# EAGLE schematic PAD05 (EAGLE 8.3.2)
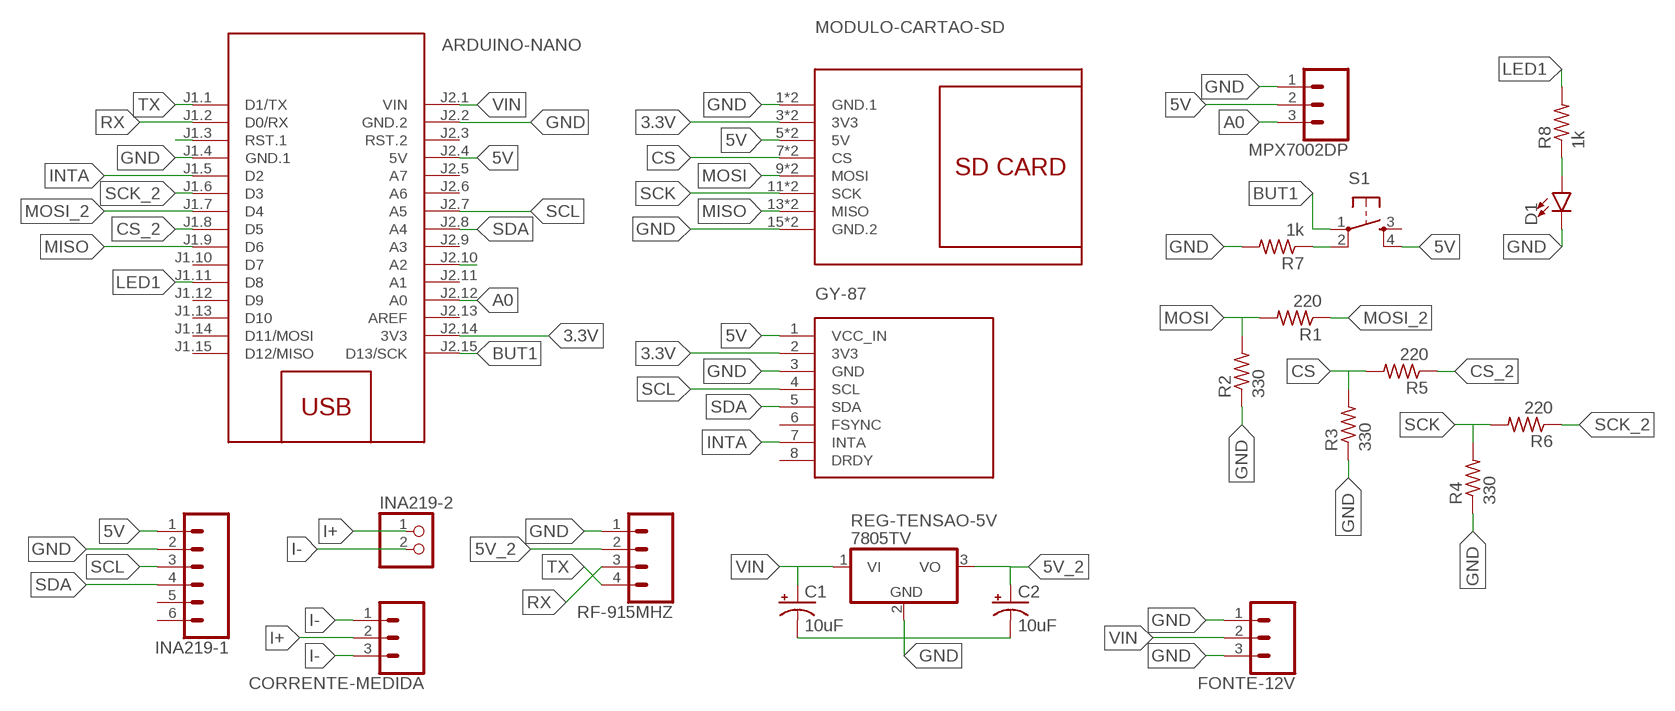
[diagram p0: schematic, sheet 1]

## Parts
ARDUINO-NANO  ARDUINO-NANO-3.0  [ARDUINO-NANO-3.0]
C1  10uF  10UF-POLAR-RADIAL-2.5MM-25V-20%  [CPOL-RADIAL-2.5MM-5MM]
C2  10uF  10UF-POLAR-RADIAL-2.5MM-25V-20%  [CPOL-RADIAL-2.5MM-5MM]
CORRENTE-MEDIDA  CONN_03POLAR  [MOLEX-1X3]
D1  LED5MM  [LED_5MM]
FONTE-12V  CONN_03POLAR  [MOLEX-1X3]
GY-87  GY-86  [GY-86]
INA219-1  CONN_06SILK_FEMALE_PTH  [1X06]
INA219-2  PINHD-1X2  [1X02]
MODULO-CARTAO-SD  CARD-SD-ADAPTER  [CARD-SD-ADAPTER]
MPX7002DP  CONN_03POLAR  [MOLEX-1X3]
R1  220  R-US_0204/7  [0204/7]
R2  330  R-US_0204/7  [0204/7]
R3  330  R-US_0204/7  [0204/7]
R4  330  R-US_0204/7  [0204/7]
R5  220  R-US_0204/7  [0204/7]
R6  220  R-US_0204/7  [0204/7]
R7  1k  R-US_0204/7  [0204/7]
R8  1k  R-US_0204/7  [0204/7]
REG-TENSAO-5V  7805TV  [TO220V]
RF-915MHZ  CONN_04  [1X04]
S1  TAC_SWITCHPTH  [TACTILE-PTH]

## Nets
3.3V: ARDUINO-NANO.J2.14(3V3) GY-87.2(3V3) MODULO-CARTAO-SD.3(3V3) MODULO-CARTAO-SD.4(3V3)
5V: ARDUINO-NANO.J1.3(RST.1) ARDUINO-NANO.J2.4(5V) GY-87.1(VCC_IN) INA219-1.1 MODULO-CARTAO-SD.5(5V) MODULO-CARTAO-SD.6(5V) MPX7002DP.2 S1.4
5V_2: C2.1(+) REG-TENSAO-5V.3(VO) RF-915MHZ.2
A0: ARDUINO-NANO.J2.12(A0) MPX7002DP.3
BUT1: ARDUINO-NANO.J2.15(D13/SCK) S1.1
CS: MODULO-CARTAO-SD.7(CS) MODULO-CARTAO-SD.8(CS) R3.2 R5.2
CS_2: ARDUINO-NANO.J1.8(D5) R5.1
GND: ARDUINO-NANO.J1.4(GND.1) ARDUINO-NANO.J2.2(GND.2) C1.2(-) C2.2(-) D1.K(C) FONTE-12V.1 FONTE-12V.3 GY-87.3(GND) INA219-1.2 MODULO-CARTAO-SD.1(GND.1) MODULO-CARTAO-SD.2(GND.1) MODULO-CARTAO-SD.15(GND.2) MODULO-CARTAO-SD.16(GND.2) MPX7002DP.1 R2.1 R3.1 R4.1 R7.2 REG-TENSAO-5V.2(GND) RF-915MHZ.1
I+: CORRENTE-MEDIDA.2 INA219-2.1
I-: CORRENTE-MEDIDA.1 CORRENTE-MEDIDA.3 INA219-2.2
INTA: ARDUINO-NANO.J1.5(D2) ARDUINO-NANO.J2.10(A2) GY-87.7(INTA)
LED1: ARDUINO-NANO.J1.11(D8) R8.2
MISO: ARDUINO-NANO.J1.9(D6) MODULO-CARTAO-SD.13(MISO) MODULO-CARTAO-SD.14(MISO)
MOSI: MODULO-CARTAO-SD.9(MOSI) MODULO-CARTAO-SD.10(MOSI) R1.2 R2.2
MOSI_2: ARDUINO-NANO.J1.7(D4) R1.1
N$1: R7.1 S1.2
N$2: D1.A R8.1
RX: ARDUINO-NANO.J1.2(D0/RX) RF-915MHZ.3
SCK: MODULO-CARTAO-SD.11(SCK) MODULO-CARTAO-SD.12(SCK) R4.2 R6.2
SCK_2: ARDUINO-NANO.J1.6(D3) R6.1
SCL: ARDUINO-NANO.J2.7(A5) GY-87.4(SCL) INA219-1.3
SDA: ARDUINO-NANO.J2.8(A4) GY-87.5(SDA) INA219-1.4
TX: ARDUINO-NANO.J1.1(D1/TX) RF-915MHZ.4
VIN: ARDUINO-NANO.J2.1(VIN) C1.1(+) FONTE-12V.2 REG-TENSAO-5V.1(VI)
Unconnected: ARDUINO-NANO.J1.10(D7) ARDUINO-NANO.J1.12(D9) ARDUINO-NANO.J1.13(D10) ARDUINO-NANO.J1.14(D11/MOSI) ARDUINO-NANO.J1.15(D12/MISO) ARDUINO-NANO.J2.3(RST.2) ARDUINO-NANO.J2.5(A7) ARDUINO-NANO.J2.6(A6) ARDUINO-NANO.J2.9(A3) ARDUINO-NANO.J2.11(A1) ARDUINO-NANO.J2.13(AREF) GY-87.6(FSYNC) GY-87.8(DRDY) INA219-1.5 INA219-1.6 S1.3

## Notes on the sheet
- GY-87

## Library data of the parts
ARDUINO-NANO = diy-modules:ARDUINO-NANO-3.0: Arduino Nano 3.0 and compatible devices More details available here: https://www.arduino.cc/en/Main/ArduinoBoardNano Click here to find device on ebay.com <http://www.ebay.com/sch/arduino+nano>
C1 C2 = SparkFun-Capacitors:10UF-POLAR: 10.0µF polarized capacitors A capacitor is a passive two-terminal electrical component used to store electrical energy temporarily in an electric field.; PROD_ID: CAP-08440
CORRENTE-MEDIDA FONTE-12V MPX7002DP = SparkFun-Connectors:CONN_03: Multi connection point. Often used as Generic Header-pin footprint for 0.1 inch spaced/style header connections On any of the 0.1 inch spaced packages, you can populate with these: Break Away Headers - Straight <https://www.sparkfun.com/products/116> (PRT-00116) Break Away Male Headers - Right Angle <https://www.sparkfun.com/products/553> (PRT-00553) Female Headers <https://www.sparkfun.com/products/115> (PRT-00115) Break Away Headers - Machine Pin <https://www.sparkfun.com/products/117> (PRT-00117) Break Away Female Headers - Swiss Machine Pin <https://www.sparkfun.com/products/743> (PRT-00743) Stackable Header - 3 Pin (Female, 0.1") <https://www.sparkfun.com/products/13875> (PRT-13875) For SCREWTERMINALS and SPRING TERMINALS visit here: Screw Terimnals on SparkFun.com <https://www.sparkfun.com/search/results?term=Screw+Terminals> (5mm/3.5mm/2.54mm spacing) This device is also useful as a general connection point to wire up your design to another part of your project. Our various solder wires solder well into these plated through hole pads. Hook-Up Wire - Assortment (Stranded, 22 AWG) <https://www.sparkfun.com/products/11375> (PRT-11375) Hook-Up Wire - Assortment (Solid Core, 22 AWG) <https://www.sparkfun.com/products/11367> (PRT-11367) View the entire wire category on our website here <https://www.sparkfun.com/categories/141> Special notes: Molex polarized connector foot print use with SKU : PRT-08232 with associated crimp pins and housings.; PROD_ID: CONN-08625; SF_ID: PRT-08096
D1 = SparkFun-LED:LED: LED (Generic) Standard schematic elements and footprints for 5mm, 3mm, 1206, and 0603 sized LEDs. Generic LEDs with no color specified.
GY-87 = GY_Boards:GY-86
INA219-1 = SparkFun-Connectors:CONN_06: Multi connection point. Often used as Generic Header-pin footprint for 0.1 inch spaced/style header connections On any of the 0.1 inch spaced packages, you can populate with these: Break Away Headers - Straight <https://www.sparkfun.com/products/116> (PRT-00116) Break Away Male Headers - Right Angle <https://www.sparkfun.com/products/553> (PRT-00553) Female Headers <https://www.sparkfun.com/products/115> (PRT-00115) Break Away Headers - Machine Pin <https://www.sparkfun.com/products/117> (PRT-00117) Break Away Female Headers - Swiss Machine Pin <https://www.sparkfun.com/products/743> (PRT-00743) Arduino Stackable Header - 6 Pin <https://www.sparkfun.com/products/9280> (PRT-09280) For SCREWTERMINALS and SPRING TERMINALS visit here: Screw Terimnals on SparkFun.com <https://www.sparkfun.com/search/results?term=Screw+Terminals> (5mm/3.5mm/2.54mm spacing) This device is also useful as a general connection point to wire up your design to another part of your project. Our various solder wires solder well into these plated through hole pads. Hook-Up Wire - Assortment (Stranded, 22 AWG) <https://www.sparkfun.com/products/11375> (PRT-11375) Hook-Up Wire - Assortment (Solid Core, 22 AWG) <https://www.sparkfun.com/products/11367> (PRT-11367) View the entire wire category on our website here <https://www.sparkfun.com/categories/141>; PROD_ID: CONN-08437
INA219-2 = pinhead:PINHD-1X2: PIN HEADER
MODULO-CARTAO-SD = diy-modules:CARD-SD-ADAPTER: Full Size SD Card Adapter Module with onboard 3.3V regulator Guide describing how to use SD card with Arduino is available here: https://www.arduino.cc/en/Reference/SDCardNotes Click here to find device on ebay.com <http://www.ebay.com/sch/sd+card+socket+module>
R1-R8 = resistor:R-US_: RESISTOR, American symbol
REG-TENSAO-5V = linear:78*: Positive VOLTAGE REGULATOR Source: http://cache.national.com/ds/LM/LM78L05.pdf http://www.fairchildsemi.com/ds/LM/LM7805.pdf
RF-915MHZ = SparkFun-Connectors:CONN_04: Multi connection point. Often used as Generic Header-pin footprint for 0.1 inch spaced/style header connections On any of the 0.1 inch spaced packages, you can populate with these: Break Away Headers - Straight <https://www.sparkfun.com/products/116> (PRT-00116) Break Away Male Headers - Right Angle <https://www.sparkfun.com/products/553> (PRT-00553) Female Headers <https://www.sparkfun.com/products/115> (PRT-00115) Break Away Headers - Machine Pin <https://www.sparkfun.com/products/117> (PRT-00117) Break Away Female Headers - Swiss Machine Pin <https://www.sparkfun.com/products/743> (PRT-00743) For SCREWTERMINALS and SPRING TERMINALS visit here: Screw Terimnals on SparkFun.com <https://www.sparkfun.com/search/results?term=Screw+Terminals> (5mm/3.5mm/2.54mm spacing) This device is also useful as a general connection point to wire up your design to another part of your project. Our various solder wires solder well into these plated through hole pads. Hook-Up Wire - Assortment (Stranded, 22 AWG) <https://www.sparkfun.com/products/11375> (PRT-11375) Hook-Up Wire - Assortment (Solid Core, 22 AWG) <https://www.sparkfun.com/products/11367> (PRT-11367) View the entire wire category on our website here <https://www.sparkfun.com/categories/141> Special notes: Molex polarized connector foot print use with SKU : PRT-08231 with associated crimp pins and housings. 1MM SMD Version SKU: PRT-10208; PROD_ID: CONN-09696
S1 = SparkFun-Retired:TAC_SWITCH: Momentary Switch Button commonly used for reset or general input. Spark Fun Electronics SKU : COM-00097 SMT- SWCH-08247

## Net classes
0 default: width 1 mm, drill 1 mm, clearance 0.025 mm